# EAGLE design RevA (EAGLE 7.5.0)
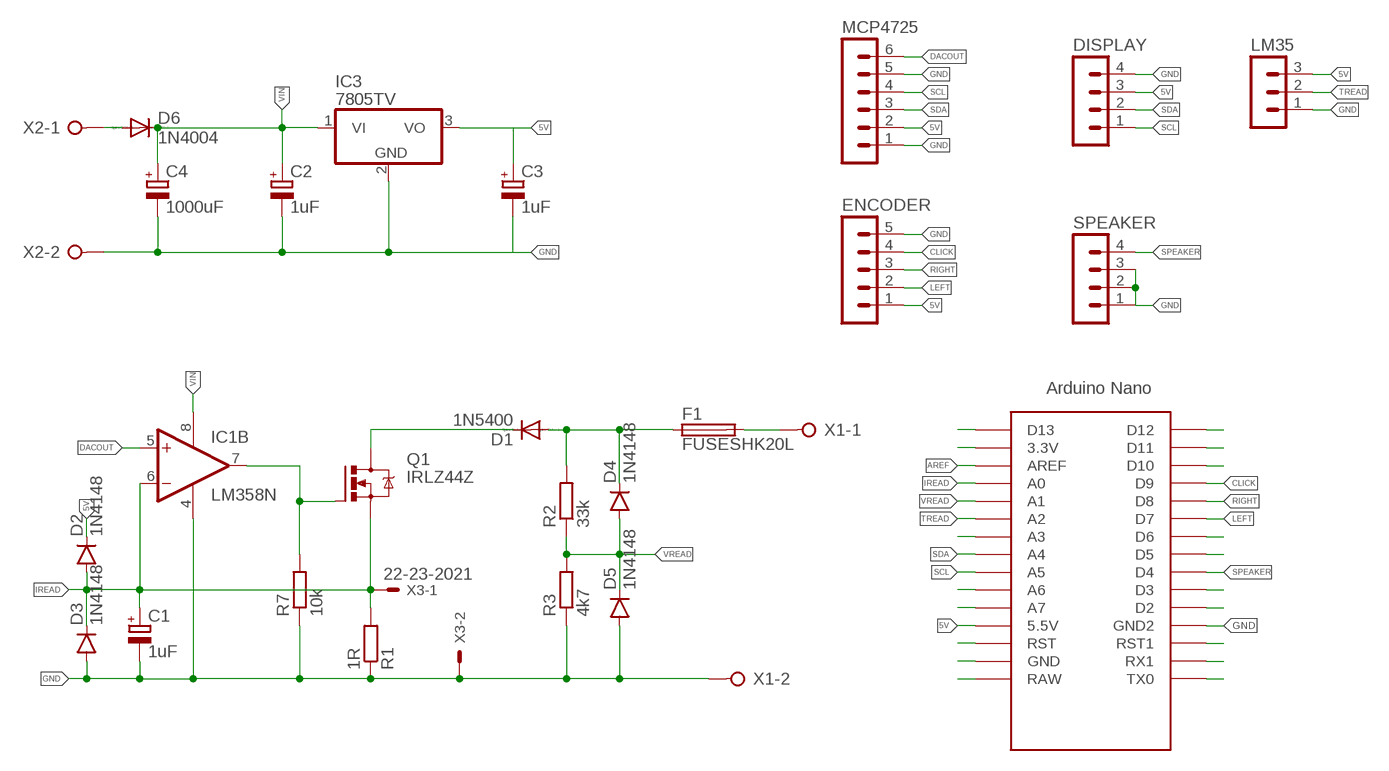
[diagram p0: schematic, sheet 1]

## Parts
C1  1uF  CPOL-EUE2-5  [E2-5]
C2  1uF  CPOL-EUE5-5  [E5-5]
C3  1uF  CPOL-EUE5-5  [E5-5]
C4  1000uF  CPOL-EUE5-10.5  [E5-10,5]
D1  1N5400  [DO201-15]
D2  1N4148  DIODE1N4148  [DIODE-1N4148]
D3  1N4148  DIODE1N4148  [DIODE-1N4148]
D4  1N4148  DIODE1N4148  [DIODE-1N4148]
D5  1N4148  DIODE1N4148  [DIODE-1N4148]
D6  1N4004  [DO41-10]
DISPLAY  MA04-1  [MA04-1]
ENCODER  MA05-1  [MA05-1]
F1  FUSESHK20L  [SHK20L]
IC1  LM358N  [DIL08]
IC3  7805TV  [TO220V]
LM35  MA03-1  [MA03-1]
MCP4725  MA06-1  [MA06-1]
Q1  IRLZ44Z  [TO220BH]
R1  1R  R-EU_0309/12  [0309/12]
R2  33k  R-EU_0207/10  [0207/10]
R3  4k7  R-EU_0207/10  [0207/10]
R7  10k  R-EU_0207/10  [0207/10]
SPEAKER  MA04-1  [MA04-1]
U$1  NANO  [NANO]
X1  W237-02P  [W237-132]
X2  W237-02P  [W237-132]
X3  22-23-2021  [22-23-2021]

## Nets
5V: C3.+ D2.C DISPLAY.3 ENCODER.1 IC3.3(VO) LM35.3 MCP4725.2 U$1.5V(5.5V)
AREF: U$1.AREF
CLICK: ENCODER.4 U$1.D9
DACOUT: IC1.5(B:+IN) MCP4725.6
GND: C1.- C2.- C3.- C4.- D3.A D5.A DISPLAY.4 ENCODER.5 IC1.4(P:V-) IC3.2(GND) LM35.1 MCP4725.1 MCP4725.5 R1.1 R3.1 R7.1 SPEAKER.1 SPEAKER.2 SPEAKER.3 U$1.GND1(GND2) X1.2 X2.2 X3.2
IREAD: C1.+ D2.A D3.C IC1.6(B:-IN) Q1.S R1.2 U$1.A0 X3.1
LEFT: ENCODER.2 U$1.D7
N$1: F1.2A X1.1
N$2: D1.A D4.C F1.1A R2.2
N$7: IC1.7(B:OUT) Q1.G R7.2
N$10: D6.A X2.1
N$11: D1.C Q1.D
N$22: U$1.D13
N$23: U$1.3.3V
N$24: U$1.A3
N$25: U$1.A6
N$26: U$1.A7
N$27: U$1.RST
N$28: U$1.GND
N$29: U$1.RAW
N$30: U$1.TX0
N$31: U$1.RX1
N$32: U$1.RST1
N$33: U$1.D2
N$34: U$1.D3
N$35: U$1.D5
N$36: U$1.D6
N$37: U$1.D10
N$38: U$1.D11
N$39: U$1.D12
RIGHT: ENCODER.3 U$1.D8
SCL: DISPLAY.1 MCP4725.4 U$1.A5
SDA: DISPLAY.2 MCP4725.3 U$1.A4
SPEAKER: SPEAKER.4 U$1.D4
TREAD: LM35.2 U$1.A2
VIN: C2.+ C4.+ D6.C IC1.8(P:V+) IC3.1(VI)
VREAD: D4.A D5.C R2.1 R3.2 U$1.A1
Unconnected: IC1.1(A:OUT) IC1.2(A:-IN) IC1.3(A:+IN) U$1.ICSP1 U$1.ICSP2 U$1.ICSP3 U$1.ICSP4 U$1.ICSP5 U$1.ICSP6

## Library data of the parts
C1-C4 = rcl:CPOL-EU: POLARIZED CAPACITOR, European symbol
D1 = diode:1N5400: DIODE standard rectifier, 3 A, 50 V (Motorola)
D2-D5 = SparkFun-DiscreteSemi:DIODE: Diode These are standard reverse protection diodes and small signal diodes. SMA package can handle up to about 1A. SOD-323 can handle about 200mA. What the SOD-323 package when ordering, there are some mfgs out there that are 5-pin packages.; PROD_ID: DIO-08378
D6 = diode:1N4004: DIODE general purpose rectifier, 1 A
DISPLAY SPEAKER = con-lstb:MA04-1: PIN HEADER; OC_FARNELL: unknown; OC_NEWARK: unknown
ENCODER = con-lstb:MA05-1: PIN HEADER; OC_FARNELL: unknown; OC_NEWARK: unknown
F1 = fuse:FUSE: Fuse; OC_FARNELL: unknown; OC_NEWARK: unknown
IC1 = linear:LM358: OP AMP also LM158; LM258; LM2904 Source: http://cache.national.com/ds/LM/LM158.pdf
IC3 = linear:78*: Positive VOLTAGE REGULATOR Source: http://cache.national.com/ds/LM/LM78L05.pdf http://www.fairchildsemi.com/ds/LM/LM7805.pdf
LM35 = con-lstb:MA03-1: PIN HEADER; OC_FARNELL: unknown; OC_NEWARK: unknown
MCP4725 = con-lstb:MA06-1: PIN HEADER; OC_FARNELL: unknown; OC_NEWARK: unknown
Q1 = transistor-power:IRLZ44Z: N-Channel HEXFET® Power MOSFET Logic Level AUTOMOTIVE MOSFET Source: http://www.irf.com/product-info/datasheets/data/irlz44zpbf.pdf
R1-R3 R7 = rcl:R-EU_: RESISTOR, European symbol
U$1 = Arduino-clone:NANO: Arduino Nano
X1 X2 = con-wago-508:W237-02P: WAGO SREW CLAMP; OC_FARNELL: unknown; OC_NEWARK: unknown
X3 = con-molex:22-23-2021: .100" (2.54mm) Center Header - 2 Pin; MF: MOLEX; MPN: 22-23-2021; OC_FARNELL: 1462926; OC_NEWARK: 25C3832

## Board
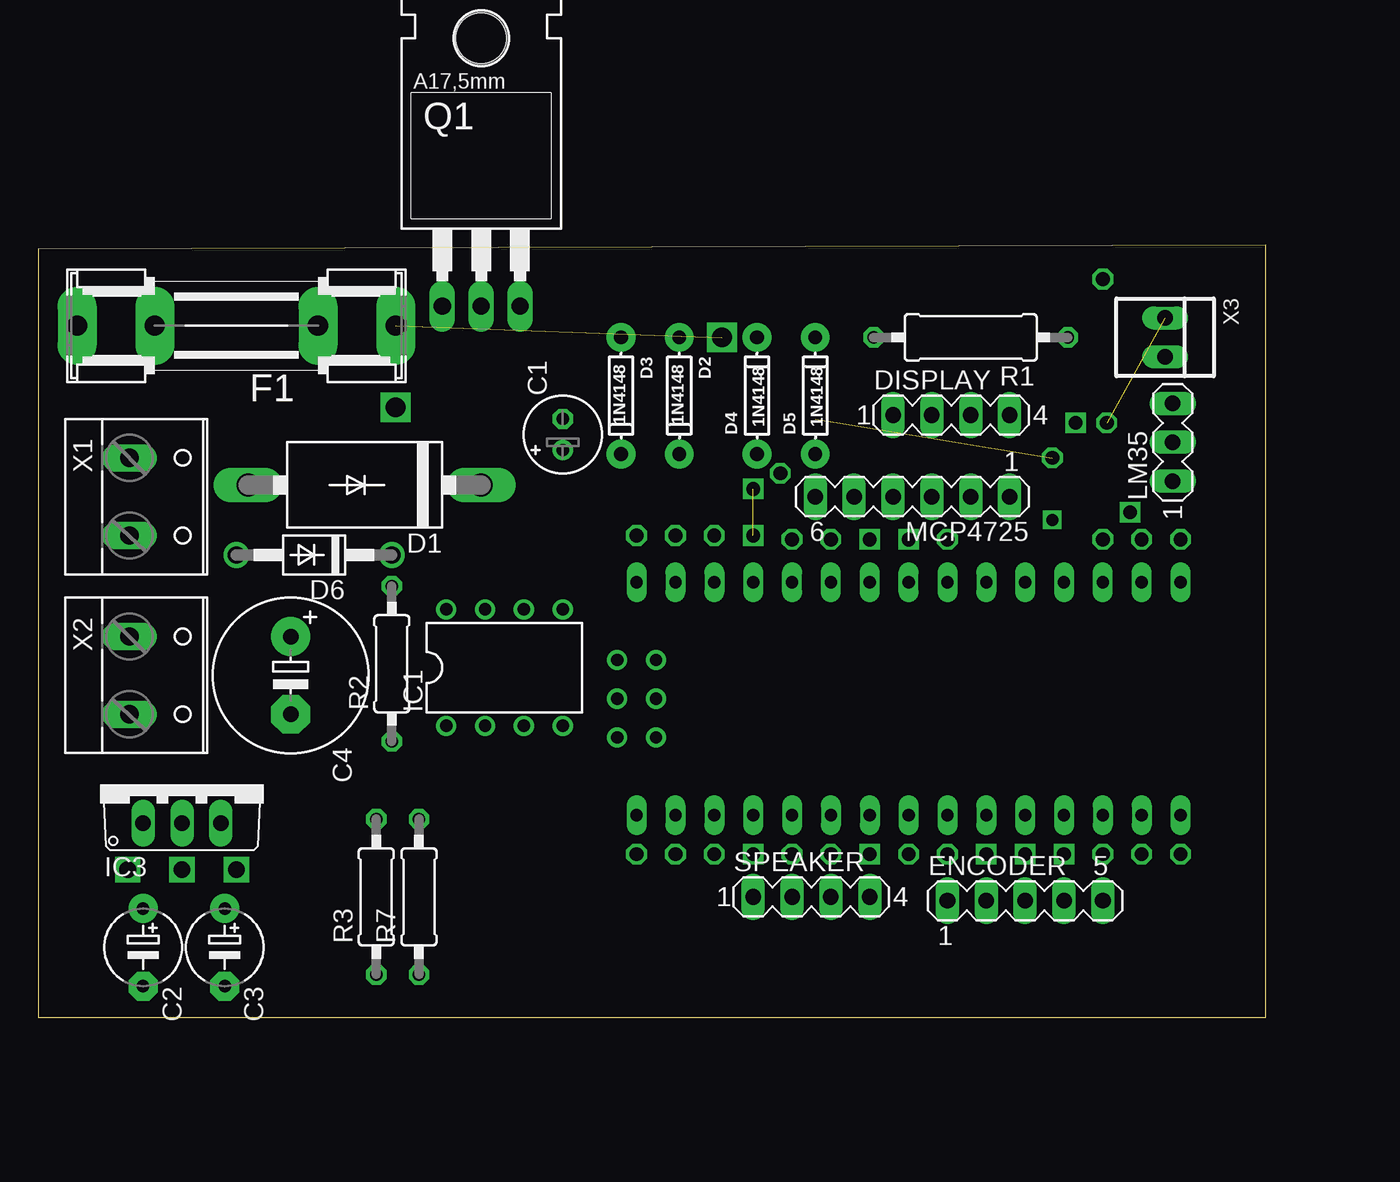
[diagram p1: board, top side]
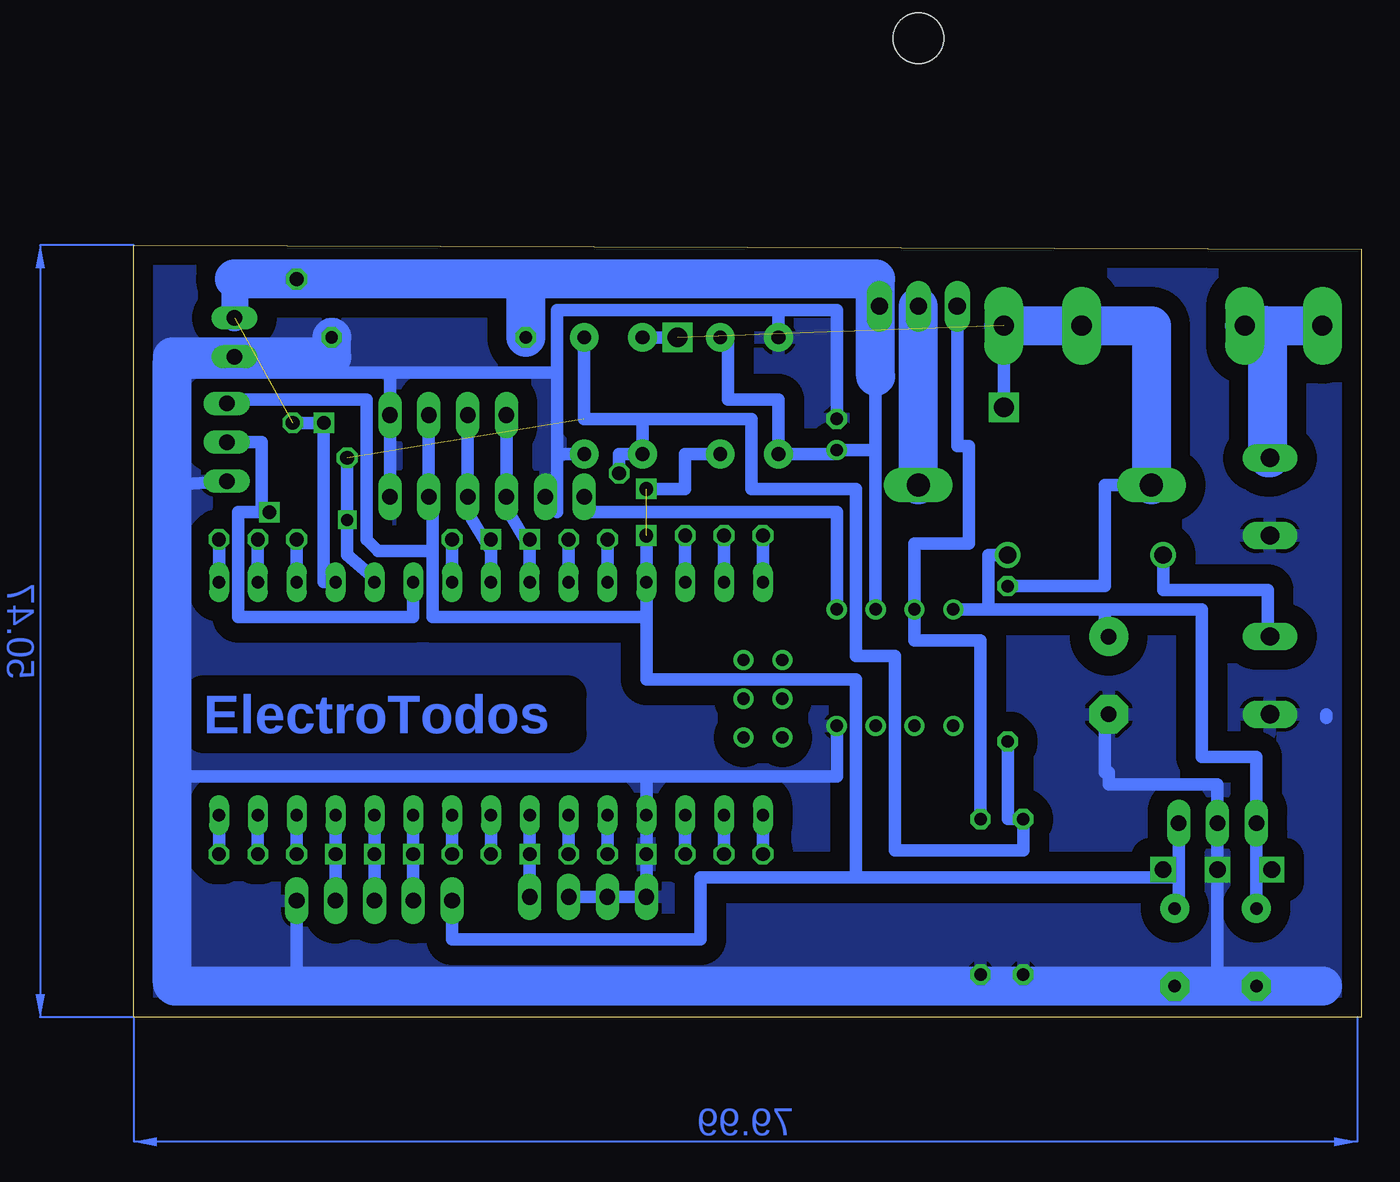
[diagram p2: board, bottom side, seen from below]

Size 80.24 x 50.47 mm. Coordinates in mm from the lower left corner, seen from the top.
Outline: 0,0 80.24,0 80.24,50.47 0,50.22 0,0
Copper layers (1*16): Top 0.035mm / dielectric 1.5mm / Bottom 0.035mm
Design rules "default": minimum track width 10mil, minimum drill 24mil, track to track 8mil, track to pad 8mil, pad to pad 8mil, via to via 8mil, smd to smd 8mil, copper to edge 40mil, drill to drill 8mil, minimum pad ring 10mil, minimum via ring 8mil, stop-mask expansion 4mil, vias tented up to drill 0mil, thermal gap 10mil

### Footprints (pad centres in the part's own frame; a part is rotated, then mirrored left to right if it is on the bottom)
E2-5 = drill 0.813 pad 1.27: + -1.016,0 | drill 0.813 pad 1.27 octagon: - 1.016,0
E5-5 = drill 0.813 pad 1.905: + -2.54,0 | drill 0.813 pad 1.905 octagon: - 2.54,0
E5-10,5 = drill 1.016 pad 2.54: + -2.54,0 | drill 1.016 pad 2.54 octagon: - 2.54,0
DO201-15 = drill 1.499 long: A 7.62,0; C -7.62,0
DIODE-1N4148 = drill 0.9 pad 1.88: A -3.81,0; C 3.81,0
DO41-10 = drill 1.118: A 5.08,0; C -5.08,0
MA04-1 = drill 1.016 long: 1 -3.81,0; 2 -1.27,0; 3 1.27,0; 4 3.81,0
MA05-1 = drill 1.016 long: 1 -5.08,0; 2 -2.54,0; 3 0,0; 4 2.54,0; 5 5.08,0
SHK20L = drill 1.321 pad 2.54 long: 1A -10.414,0; 1B -5.334,0; 2A 10.414,0; 2B 5.334,0
DIL08 = drill 0.813 pad 1.27: 1 -3.81,-3.81; 2 -1.27,-3.81; 3 1.27,-3.81; 4 3.81,-3.81; 5 3.81,3.81; 6 1.27,3.81; 7 -1.27,3.81; 8 -3.81,3.81
TO220V = drill 1.016 long: 1 -2.54,-2.54; 2 0,-2.54; 3 2.54,-2.54
MA03-1 = drill 1.016 long: 1 -2.54,0; 2 0,0; 3 2.54,0
MA06-1 = drill 1.016 long: 1 -6.35,0; 2 -3.81,0; 3 -1.27,0; 4 1.27,0; 5 3.81,0; 6 6.35,0
TO220BH = drill 1.118 long: D 0,-6.35; G -2.54,-6.35; S 2.54,-6.35 | hole 3.302: 0,11.176
0309/12 = drill 0.813 octagon: 1 -6.35,0; 2 6.35,0
0207/10 = drill 0.813 octagon: 1 -5.08,0; 2 5.08,0
NANO = drill 0.8 long: 3.3V -10.16,24.13; 5V -10.16,-1.27; A0 -10.16,19.05; A1 -10.16,16.51; A2 -10.16,13.97; A3 -10.16,11.43; A4 -10.16,8.89; A5 -10.16,6.35; A6 -10.16,3.81; A7 -10.16,1.27; AREF -10.16,21.59; D2 5.08,1.27; D3 5.08,3.81; D4 5.08,6.35; D5 5.08,8.89; D6 5.08,11.43; D7 5.08,13.97; D8 5.08,16.51; D9 5.08,19.05; D10 5.08,21.59; D11 5.08,24.13; D12 5.08,26.67; D13 -10.16,26.67; GND -10.16,-6.35; GND1 5.08,-1.27; RAW -10.16,-8.89; RST -10.16,-3.81; RST1 5.08,-3.81; RX1 5.08,-6.35; TX0 5.08,-8.89 | drill 0.8: ICSP1 -5.08,-10.16; ICSP2 -5.08,-7.62; ICSP3 -2.54,-10.16; ICSP4 -2.54,-7.62; ICSP5 0,-10.16; ICSP6 0,-7.62
W237-132 = drill 1.194 long: 1 -2.54,-0.635; 2 2.54,-0.635
22-23-2021 = drill 1 long: 1 -1.27,0; 2 1.27,0

### Placement (x,y rotation side)
C1  34.29,38.1 90 top
C2  6.86,4.57 270 top
C3  12.19,4.57 270 top
C4  16.51,22.35 270 top
D1  21.34,34.8 180 top
D2  41.91,40.64 270 top
D3  38.1,40.64 270 top
D4  46.99,40.64 90 top
D5  50.8,40.64 90 top
D6  18.03,30.23 180 top
DISPLAY  59.69,39.37 0 top
ENCODER  64.52,7.62 0 top
F1  12.95,45.21 180 top
IC1  30.48,22.86 0 top
IC3  9.4,15.24 0 top
LM35  74.17,37.59 90 top
MCP4725  57.15,34.04 180 top
Q1  28.96,52.83 0 top
R1  60.96,44.45 180 top
R2  23.11,23.11 90 top
R3  22.1,7.87 90 top
R7  24.89,7.87 90 top
SPEAKER  50.55,7.87 0 top
U$1  48.01,18.29 270 top
X1  6.6,34.04 270 top
X2  6.6,22.35 270 top
X3  73.66,44.45 270 top

### Tracks (layer width: path | path; a pad name or v marks a point on that pad's centre or on a via)
5V  (1 unrouted)
  Bottom 0.813: DISPLAY.3 MCP4725.2 60.71,33.02 60.71,30.48 | 46.74,26.16 U$1.5V 46.74,31.5 | 46.74,26.16 60.71,26.16 60.71,30.48 | C3.+ 11.94,7.11 11.94,9.14 | IC3.3 11.94,9.14 | 11.94,9.14 33.02,9.14 | 33.02,9.14 33.02,22.1 46.74,22.1 46.74,26.16 | D2.C 44.2,36.83 44.2,34.54 46.74,34.54 | LM35.3 73.41,40.39 65.02,40.39 65.02,31.24 64.26,30.48 60.71,30.48 | ENCODER.1 59.44,5.08 43.18,5.08 43.18,9.14 33.02,9.14
AREF  (via drill 0.9)
  Bottom 0.813: U$1.AREF v69.6,31.24
CLICK  (via drill 0.9)
  Bottom 0.813: U$1.D9 v67.06,10.67 ENCODER.4
DACOUT
  Bottom 0.813: IC1.5 34.29,33.02 50.8,33.02 MCP4725.6
GND  (via drill 0.9, 1.1)
  Bottom 0.813: 63.5,42.16 DISPLAY.4 MCP4725.1 | 63.5,42.16 77.22,42.16 67.31,43.18 | 52.58,36.83 D5.A | C1.- 34.29,46.23 38.1,46.23 | D3.A 38.1,46.23 | 38.1,46.23 52.58,46.23 52.58,42.16 | 52.58,42.16 63.5,42.16 | 2.54,2.03 C2.- 9.4,3.05 v9.4,9.65 IC3.2 9.4,15.24 16.51,15.24 16.51,16 16.76,16 16.76,19.81 C4.- | C3.- 15.24,2.03 | 20.57,2.29 20.57,2.03 20.57,1.27 | 29.46,2.03 26.42,1.27 arc90 R7.1 arc90 28.7,2.03 28.7,1.52 77.47,1.52 77.47,15.75 46.74,15.75 | ENCODER.5 69.6,2.03 | 52.58,36.83 52.58,42.16 | LM35.1 77.72,34.8 | R3.1 17.78,2.03 | MCP4725.5 52.58,33.02 52.58,36.83 | IC1.4 34.29,15.75 46.74,15.75 | 46.74,15.75 U$1.GND1 v46.74,10.67 SPEAKER.1 SPEAKER.2 SPEAKER.3 | 2.29,19.81 2.29,19.56
  Bottom 2.54: R1.1 67.31,43.18 X3.2 77.72,43.18 arc90 77.72,42.93 77.72,34.8 77.72,2.29 arc-90 77.47,2.03 69.6,2.03 29.46,2.03 20.57,2.03 17.78,2.03 15.24,2.03 2.54,2.03
  pour Bottom (isolate 1.27): 0.25,50.29 80.26,50.55 80.26,0 0,0
IREAD  (via drill 0.9)  (1 unrouted)
  Bottom 0.813: IC1.6 31.75,37.08 | D2.A 41.4,44.45 41.4,40.39 38.1,40.39 D3.C 34.29,36.83 C1.+ 31.75,37.08 | 31.75,37.08 31.75,41.91 | U$1.A0 67.82,28.45 v67.82,38.86 69.85,38.86 | X3.1 73.66,48.51 69.34,48.51 v69.6,48.26
  Bottom 1.778: Q1.S 31.75,41.91 | 73.66,48.26 X3.1
  Bottom 2.54: 31.75,41.91 31.75,48.26 54.61,48.26 | R1.2 54.61,48.26 | 54.61,48.26 v69.6,48.26 73.66,48.26
LEFT  (via drill 0.9)
  Bottom 0.813: ENCODER.2 v61.98,10.67 U$1.D7
N$1
  Bottom 2.54: X1.1 6.1,36.58 6.1,45.21 | 6.1,45.21 7.62,45.21 | 6.1,45.21 F1.2A
N$2  (via drill 1.3)  (1 unrouted)
  Bottom 0.813: D4.C v44.7,44.45 | v23.37,39.88 F1.1A | R2.2 16.76,28.19 16.76,34.8 D1.A
  Bottom 2.54: F1.1A 13.72,45.21 D1.A
N$4  (via drill 0.9)
  other vias: 46.74,34.54
N$5  (via drill 0.9)
  other vias: 46.74,31.5
N$6  (via drill 0.9)
  other vias: 48.51,35.56
N$7
  Bottom 0.813: R7.2 24.89,24.64 29.21,24.64 IC1.7 29.21,30.99 25.65,30.99 25.65,37.34 26.42,37.34 Q1.G
N$8  (via drill 0.9)
  other vias: 66.29,36.58
N$9  (via drill 0.9)
  other vias: 69.85,38.86
N$10
  Bottom 0.813: X2.1 6.1,24.89 6.1,27.94 12.95,27.94 D6.A
N$11
  Bottom 2.54: D1.C Q1.D
N$13  (via drill 0.9)
  other vias: 59.44,10.67
N$14  (via drill 0.9)
  other vias: 71.37,33.02
N$15  (via drill 0.9)
  other vias: 54.36,31.24
N$16  (via drill 0.9)
  Bottom 0.813: 74.68,13.46 v74.68,10.67
N$17  (via drill 0.9)
  other vias: 56.9,31.24
N$18  (via drill 1.1)
  other vias: 12.95,9.65
N$19  (via drill 0.9)
  other vias: 44.2,10.67
N$20  (via drill 1.1)
  other vias: 5.84,9.65
N$21  (via drill 0.9)
  Bottom 0.813: 39.12,12.95 v39.12,10.67
N$22  (via drill 0.9)
  Bottom 0.813: U$1.D13 74.68,30.73 74.68,30.99 v74.68,31.24
N$23
  Bottom 0.813: U$1.3.3V 72.14,30.73 72.14,30.99 72.14,31.5
N$24  (via drill 0.9)
  Bottom 0.813: U$1.A3 v59.44,31.24
N$25  (via drill 0.9)
  Bottom 0.813: U$1.A6 v51.82,31.24
N$26  (via drill 0.9)
  Bottom 0.813: U$1.A7 v49.28,31.24
N$27  (via drill 0.9)
  Bottom 0.813: U$1.RST v44.2,31.5
N$28  (via drill 0.9)
  Bottom 0.813: U$1.GND v41.66,31.5
N$29  (via drill 0.9)
  Bottom 0.813: U$1.RAW v39.12,31.5
N$31  (via drill 0.9)
  Bottom 0.813: U$1.RX1 v41.66,10.67
N$32
  Bottom 0.813: U$1.RST1 44.2,10.41
N$33  (via drill 0.9)
  Bottom 0.813: U$1.D2 v49.28,10.67
N$34  (via drill 0.9)
  Bottom 0.813: U$1.D3 v51.82,10.67
N$35  (via drill 0.9)
  Bottom 0.813: U$1.D5 v56.9,10.67
N$36
  Bottom 0.813: U$1.D6 59.44,10.41
N$37  (via drill 0.9)
  Bottom 0.813: U$1.D10 v69.6,10.67
N$38  (via drill 0.9)
  Bottom 0.813: U$1.D11 v72.14,10.67
N$40
  Bottom 0.813: 39.12,13.46 39.12,10.41
N$41  (via drill 0.9)
  other vias: 72.14,31.24
RIGHT  (via drill 0.9)
  Bottom 0.813: ENCODER.3 v64.52,10.67 U$1.D8
SCL
  Bottom 0.813: DISPLAY.1 MCP4725.4 55.88,33.27 54.36,30.73 U$1.A5
SDA
  Bottom 0.813: U$1.A4 56.9,30.48 58.42,33.02 MCP4725.3 DISPLAY.2
SPEAKER  (via drill 0.9)
  Bottom 0.813: SPEAKER.4 v54.36,10.67 U$1.D4
TREAD
  Bottom 0.813: U$1.A2 61.98,26.16 73.41,26.16 73.41,33.02 71.88,33.02 71.88,37.59 LM35.2
VIN
  Bottom 0.813: C2.+ IC3.1 6.86,17.02 10.41,17.02 10.41,26.67 16.76,26.67 | IC1.8 24.38,26.67 | 24.38,26.67 16.76,26.67 | D6.C 24.38,30.23 24.38,26.67 | C4.+ 16.76,24.89 16.76,26.67
VREAD  (via drill 0.8)  (1 unrouted)
  Bottom 0.813: 46.99,39.12 D4.A 48.51,36.83 48.51,35.56 | 46.99,39.12 50.8,39.12 D5.C | R2.1 23.11,12.95 R3.2 22.1,10.92 30.48,10.92 30.48,23.62 33.02,23.62 33.02,34.54 39.88,34.54 39.88,39.12 46.99,39.12 | U$1.A1 64.52,28.7 66.29,30.23 v66.29,32.51 66.29,36.58
(copper drawn outside any net)
  shapes: Bottom area x2

### Text on the board
Bottom: ElectroTodos